# Altium schematic sheet RVPOVP.SchDoc
size A; Organization: Cal Poly Racing; engineer1: who?
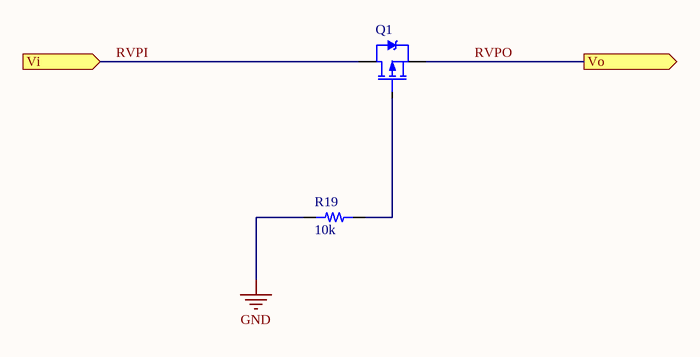
[diagram p0: RVPOVP.SchDoc]

## Parts
Q1  DMP3010LK3-13  [DMP3010LK3-13]  (value not drawn)
R19  10k  [RES 0603/1608]

## Ports
Vi (in), Vo (out)

## Nets
GND: R19.1
RVPI: Q1.3(D) ; port Vi
RVPO: Q1.2(S) ; port Vo
NetQ1_1: Q1.1(G) R19.2

## Notes on the sheet
- Date:
- Time:
- File:

## Library data of the parts
Q1 = 26: P-Channel MOSFET 30V 17A TO252; Manufacturer_id: 1; idFuse: 3; id: 26; type: P_Channel; vdsmax: 30; rdson: 8mOhm; vgsmax: 20; Drawer_id: 1; Name: DMP3010LK3-13; numcircuits: 1; current: 17A; package: TO-252-3; quantity: 0; link: https://www.digikey.com/product-detail/en/diodes-incorporated/DMP3010LK3-13/DMP3010LK3-13DICT-ND/3076574; createdby: Kevin
R19 = 1: id: 1; name: 0603 Resistor; percent tolerance: 5; resistance: 10k; package: 0603; quantity: 0